# Altium schematic sheet Analog_Signal.SchDoc
size 594 x 420 mm; SheetNumber: 2; SheetTotal: 3
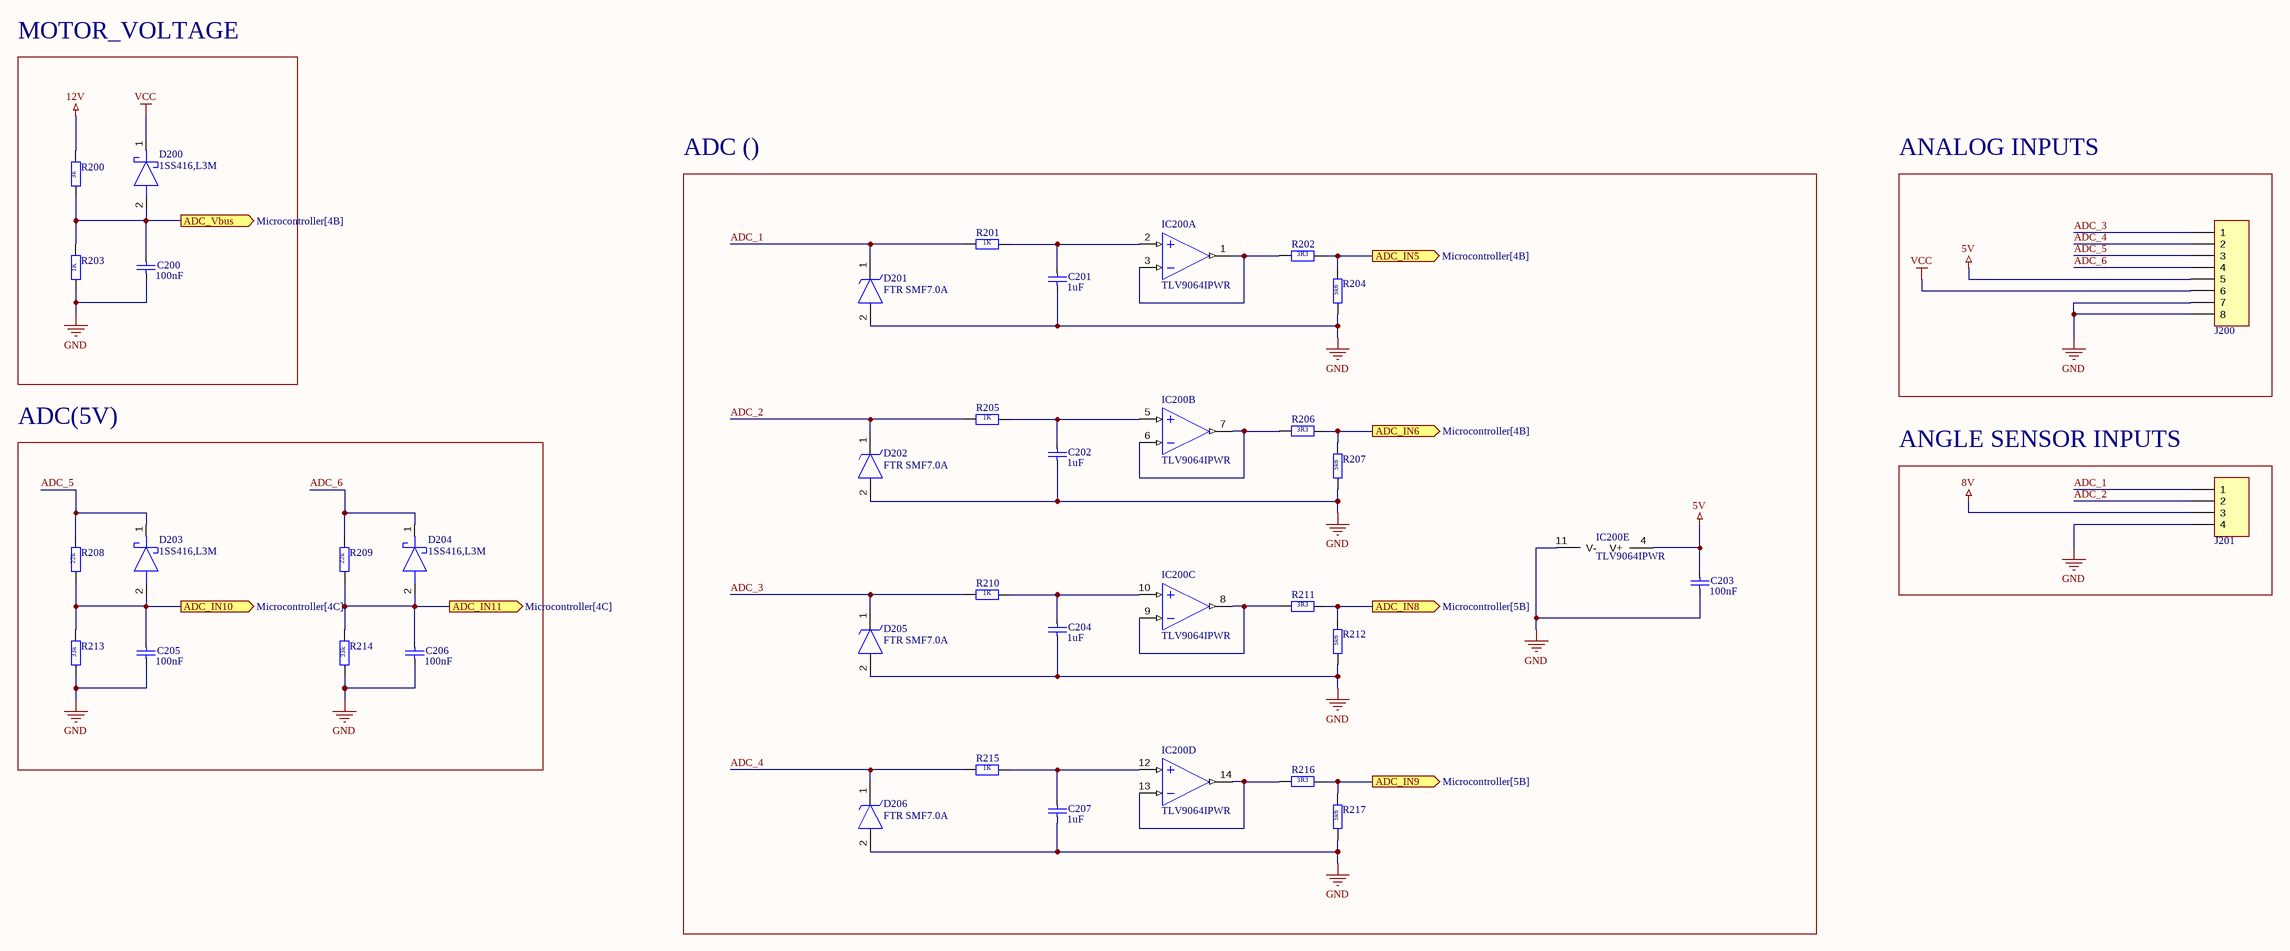
[diagram p0: Analog_Signal.SchDoc]

## Parts
C200  value 100nF  [CAPC1608X09N]  (hidden comment: C)
C201  value 1uF  [CAPC1608X09N]  (hidden comment: C)
C202  value 1uF  [CAPC1608X09N]  (hidden comment: C)
C203  value 100nF  [CAPC1608X09N]  (hidden comment: C)
C204  value 1uF  [CAPC1608X09N]  (hidden comment: C)
C205  value 100nF  [CAPC1608X09N]  (hidden comment: C)
C206  value 100nF  [CAPC1608X09N]  (hidden comment: C)
C207  value 1uF  [CAPC1608X09N]  (hidden comment: C)
D200  1SS416,L3M  [SODFL1006X45N]
D201  FTR SMF7.0A  [SMF70ATP]
D202  FTR SMF7.0A  [SMF70ATP]
D203  1SS416,L3M  [SODFL1006X45N]
D204  1SS416,L3M  [SODFL1006X45N]
D205  FTR SMF7.0A  [SMF70ATP]
D206  FTR SMF7.0A  [SMF70ATP]
IC200  TLV9064IPWR  [SOP65P640X120-14N]  (parts A,B,C,D,E of 5)
J200  XH2.54-8P  [XH2.54-8P]  (value not drawn)
J201  XH2.54-4P  [XH2.54-4P]  (value not drawn)
R200  value 3k  [RESC1608X06N]  (hidden comment: R)
R201  value 1K  [RESC1608X06N]  (hidden comment: R)
R202  value 3R3  [RESC1608X06N]  (hidden comment: R)
R203  value 1K  [RESC1608X06N]  (hidden comment: R)
R204  value 5k6  [RESC1608X06N]  (hidden comment: R)
R205  value 1K  [RESC1608X06N]  (hidden comment: R)
R206  value 3R3  [RESC1608X06N]  (hidden comment: R)
R207  value 5k6  [RESC1608X06N]  (hidden comment: R)
R208  value 22k  [RESC1608X06N]  (hidden comment: R)
R209  value 22k  [RESC1608X06N]  (hidden comment: R)
R210  value 1K  [RESC1608X06N]  (hidden comment: R)
R211  value 3R3  [RESC1608X06N]  (hidden comment: R)
R212  value 5k6  [RESC1608X06N]  (hidden comment: R)
R213  value 33k  [RESC1608X06N]  (hidden comment: R)
R214  value 33k  [RESC1608X06N]  (hidden comment: R)
R215  value 1K  [RESC1608X06N]  (hidden comment: R)
R216  value 3R3  [RESC1608X06N]  (hidden comment: R)
R217  value 5k6  [RESC1608X06N]  (hidden comment: R)

## Blocks framed on the sheet
MOTOR_VOLTAGE: C200 D200 R200 R203
ADC (): C201-C204 C207 D201 D202 D205 D206 IC200 R201 R202 R204-R207 R210-R212 R215-R217
ANALOG INPUTS: J200
ADC(5V): C205 C206 D203 D204 R208 R209 R213 R214
ANGLE SENSOR INPUTS: J201

## Ports
ADC_IN5 (out, see Microcontroller[4B]), ADC_IN6 (out, see Microcontroller[4B]), ADC_IN8 (out, see Microcontroller[5B]), ADC_IN9 (out, see Microcontroller[5B]), ADC_IN10 (out, see Microcontroller[4C]), ADC_IN11 (out, see Microcontroller[4C]), ADC_Vbus (out, see Microcontroller[4B])

## Nets
5V: C203.2 IC200.4(V+) J200.5
8V: J201.3
12V: R200.2
GND: C200.1 C201.1 C202.1 C203.1 C204.1 C205.1 C206.1 C207.1 D201.2(A) D202.2(A) D205.2(A) D206.2(A) IC200.11(V-) J200.7 J200.8 J201.4 R203.1 R204.1 R207.1 R212.1 R213.1 R214.1 R217.1
VCC: D200.1(K) J200.6
ADC_1: D201.1(K) J201.1 R201.2
ADC_2: D202.1(K) J201.2 R205.2
ADC_3: D205.1(K) J200.1 R210.2
ADC_4: D206.1(K) J200.2 R215.2
ADC_5: D203.1(K) J200.3 R208.2
ADC_6: D204.1(K) J200.4 R209.2
ADC_IN5: R202.1 R204.2 ; port ADC_IN5
ADC_IN6: R206.1 R207.2 ; port ADC_IN6
ADC_IN8: R211.1 R212.2 ; port ADC_IN8
ADC_IN9: R216.1 R217.2 ; port ADC_IN9
ADC_IN10: C205.2 D203.2(A) R208.1 R213.2 ; port ADC_IN10
ADC_IN11: C206.2 D204.2(A) R209.1 R214.2 ; port ADC_IN11
ADC_Vbus: C200.2 D200.2(A) R200.1 R203.2 ; port ADC_Vbus
NetC201_2: C201.2 IC200.2(IN1-) R201.1
NetC202_2: C202.2 IC200.5(IN2+) R205.1
NetC204_2: C204.2 IC200.10(IN3+) R210.1
NetC207_2: C207.2 IC200.12(IN4+) R215.1
NetIC200_1: IC200.1(OUT1) IC200.3(IN1+) R202.2
NetIC200_6: IC200.6(IN2-) IC200.7(OUT2) R206.2
NetIC200_8: IC200.8(OUT3) IC200.9(IN3-) R211.2
NetIC200_13: IC200.13(IN4-) IC200.14(OUT4) R216.2

## Notes on the sheet
- DWG NO:
- REV:
- THIS DOCUMENT AND THE DATA DISCLOSED HEREIN OR
- HEREWITH IS THE PROPERTY OF ALTIUM LIMITED AND MAY
- BE FREELY DISTRIBUTED IN WHOLE. NO RIGHTS ARE
- RESERVED OR EXPRESS OR IMPLIED WARANTEE GIVEN.
- REVISION
- DESCRIPTION
- DATE
- APPROVED
- ENG:
- APPROVALS
- PROJECT
- DSN:
- CHK:
- REFERENCE DOCUMENTS
- PROJECT REVISION:
- TITLE
- DOCUMENT REVISION:
- DESIGN ITEM:
- BOM:
- FAB DWG:
- PCB DWG:
- ASSY DWG:
- SCALE:
- A2
- SIZE
- CAGE CODE
- FILE NAME
- DWG NO.
- SHEET
- OF
- REV

## Library data of the parts
C200 C203 C205 C206 = C: MPN: 06033C104KAT4A; Link: https://www.lcsc.com/product-detail/Multilayer-Ceramic-Capacitors-MLCC-SMD-SMT_Kyocera-AVX-06033C104KAT4A_C2167104.html
C201 C202 C204 C207 = C: MPN: CL10B105KP8NNNC; Link: https://www.lcsc.com/search?q=CL10B105KP8NNNC&s_z=n_CL10B105KP8NNNC
D200 D203 D204 = 1SS416,L3M: Schottky Diode; Manufacturer_Name: Toshiba; MPN: 1SS416,L3M(B; Datasheet Link: https://www.lcsc.com/datasheet/lcsc_datasheet_2410122003_TOSHIBA-1SS416-L3M-B_C2943683.pdf; Height: 0.45mm; LCSC Part Number: C2943683; LCSC Price/Stock: https://www.lcsc.com/product-detail/Schottky-Diodes_TOSHIBA-1SS416-L3M-B_C2943683.html?s_z=n_1SS416,L3M; Arrow Part Number: 1SS416,L3M
  D200: Link: https://www.lcsc.com/product-detail/Schottky-Diodes_TOSHIBA-1SS416-L3M-B_C2943683.html?s_z=n_1SS416,L3M
  D203 D204: Arrow Price/Stock: https://www.lcsc.com/product-detail/Schottky-Diodes_TOSHIBA-1SS416-L3M-B_C2943683.html?s_z=n_1SS416,L3M
D201 D202 D205 D206 = SMF7.0A-TP: TVS Diode (Uni-directional); Datasheet Link: https://www.lcsc.com/datasheet/lcsc_datasheet_2304140030_FTR-SMF7-0A_C707468.pdf; Height: 1.35mm; Manufacturer_Name: FTR; MPN: SMF7.0A; LCSC Part Number: C707468; LCSC Price/Stock: https://www.lcsc.com/product-detail/ESD-and-Surge-Protection-TVS-ESD_FTR-SMF7-0A_C707468.html.; Arrow Part Number: FTR SMF7.0A; Link: https://www.lcsc.com/product-detail/ESD-and-Surge-Protection-TVS-ESD_FTR-SMF7-0A_C707468.html.
IC200 = TLV9064IPWR: Integrated Circuit; Manufacturer_Name: Texas Instruments; Datasheet Link: http://www.ti.com/lit/ds/symlink/tlv9064.pdf; Height: 1.2mm; MPN: TLV9064IPWR; Mouser Part Number: 595-TLV9064IPWR; Mouser Price/Stock: https://www.mouser.co.uk/ProductDetail/Texas-Instruments/TLV9064IPWR?qs=W0yvOO0ixfHY9ZUvwjcceA%3D%3D; Arrow Part Number: TLV9064IPWR; Arrow Price/Stock: https://www.arrow.com/en/products/tlv9064ipwr/texas-instruments?utm_currency=USD&region=nac
J200 = XH2.54-8P: MPN: XY-XH2.54-8A11; Link: https://www.lcsc.com/product-detail/Wire-To-Board-Connector_XYECONN-XY-XH2-54-8A11_C19271374.html?s_z=n_XH2.54%208p
J201 = XH2.54-4P: MPN: BX-XH2.54-4PZZ; Link: https://www.lcsc.com/product-detail/Wire-To-Board-Connector_Bossie-BX-XH2-54-4PZZ_C18077835.html?s_z=n_BX-XH2.54-4PZZ
R200 = R: MPN: 0603WAF3001T5E; Link: https://www.lcsc.com/product-detail/Chip-Resistor-Surface-Mount_UNI-ROYAL-Uniroyal-Elec-0603WAF3001T5E_C4211.html
R201 R203 R205 R210 R215 = R: MPN: 0603WAF1001T5E; Link: https://www.lcsc.com/product-detail/Chip-Resistor-Surface-Mount_UNI-ROYAL-Uniroyal-Elec-0603WAF1001T5E_C21190.html
R202 R206 R211 R216 = R: MPN: 0603WAF3301T5E; Link: https://www.lcsc.com/product-detail/Chip-Resistor-Surface-Mount_UNI-ROYAL-Uniroyal-Elec-0603WAF3301T5E_C22978.html?s_z=n_0603WAF3301T5E
R204 R207 R212 R217 = R: MPN: 0603WAF5601T5E; Link: https://www.lcsc.com/product-detail/Chip-Resistor-Surface-Mount_UNI-ROYAL-Uniroyal-Elec-0603WAF5601T5E_C23189.html
R208 R209 = R: MPN: 0603WAF2202T5E; Link: https://www.lcsc.com/product-detail/Chip-Resistor-Surface-Mount_UNI-ROYAL-Uniroyal-Elec-0603WAF2202T5E_C31850.html?s_z=n_resistor
R213 R214 = R: MPN: RC0603FR-0733KL; Link: https://www.lcsc.com/product-detail/Chip-Resistor-Surface-Mount_YAGEO-RC0603FR-0733KL_C126359.html?s_z=n_resistor